# Altium schematic sheet ADSP_3.SchDoc
size A4
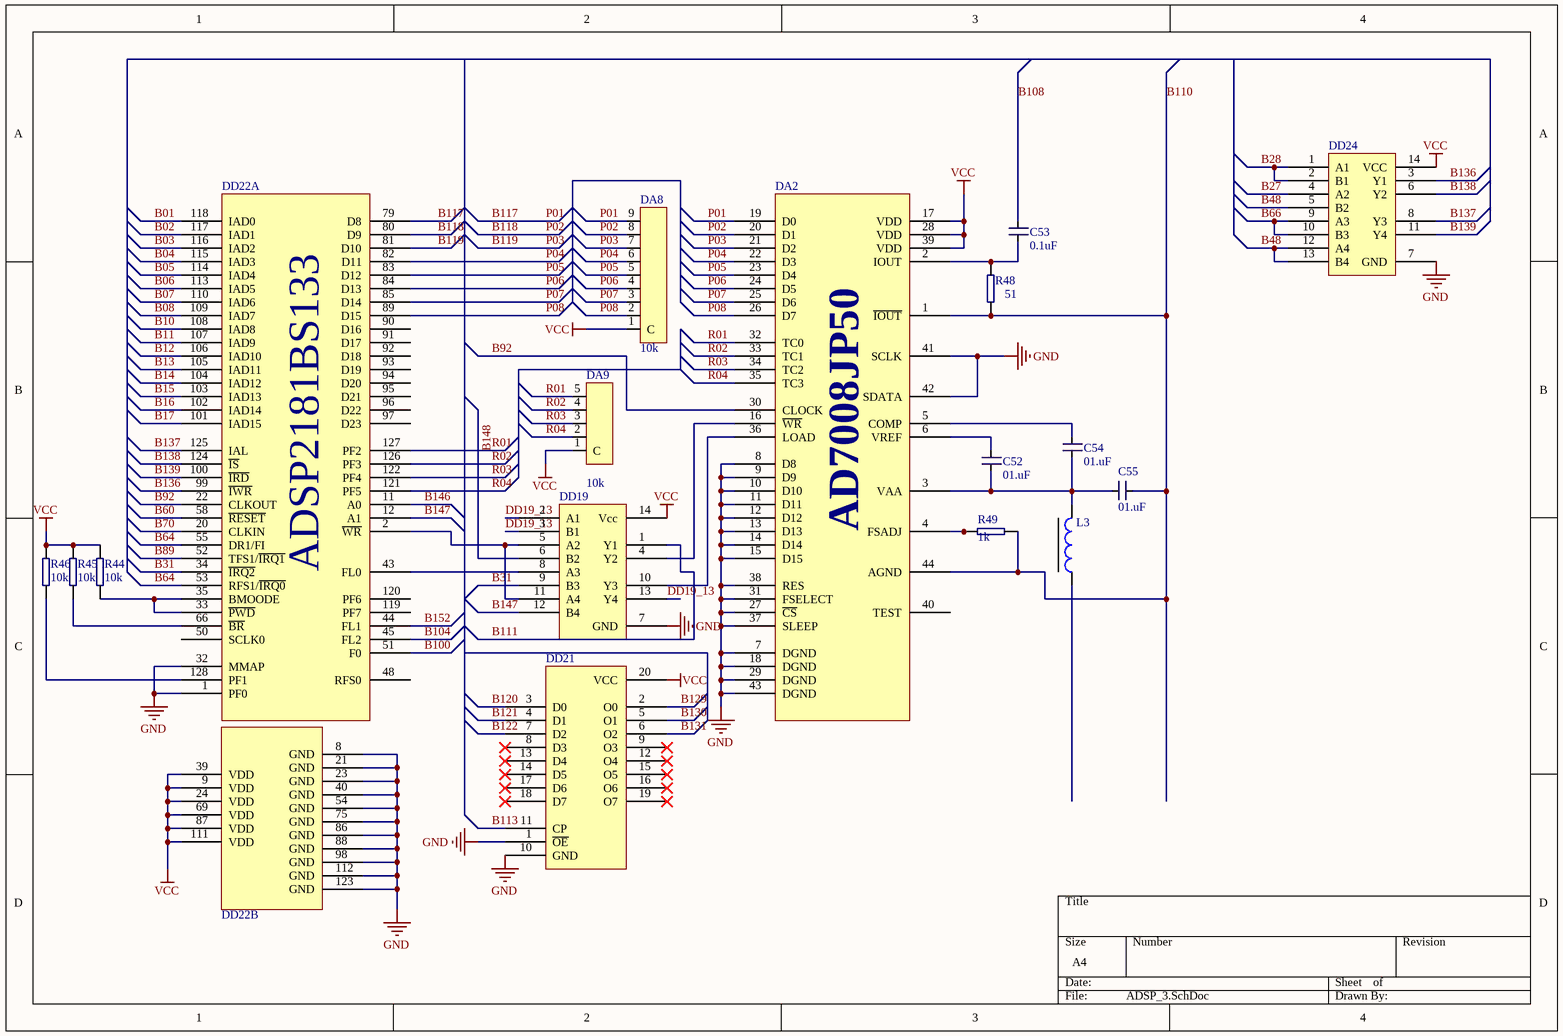
[diagram p0: ADSP_3.SchDoc]

## Parts
C52  value 01.uF  [0805]  (hidden comment: Cap)
C53  value 0.1uF  [0805]  (hidden comment: Cap)
C54  value 01.uF  [0805]  (hidden comment: Cap)
C55  value 01.uF  [0805]  (hidden comment: Cap)
DA2  AD7008JP50  [44 PLCC]  (value not drawn)
DA8  value 10k  [SIP9]  (hidden comment: 9A103J)
DA9  value 10k  [SIP5]  (hidden comment: 5A103J)
DD19  IN74AC02D  [14 SOIC-3.9]  (value not drawn)
DD21  SN74AC374D  [20 SOIC-7.5]  (value not drawn)
DD22  ADSP2181BS1332  [128 PQFP]  (value not drawn)  (parts A,B of 2)
DD24  IN74AC08D  [14 TSSOP-4.4]  (value not drawn)
L3  L  [E(1820)]  (value not drawn)
R44  value 10k  [0805]  (hidden comment: R)
R45  value 10k  [0805]  (hidden comment: R)
R46  value 10k  [0805]  (hidden comment: R)
R48  value 51  [0805]  (hidden comment: R)
R49  value 1k  [0805]  (hidden comment: R)

## Nets
GND: DA2.7(DGND) DA2.8(D8) DA2.9(D9) DA2.10(D10) DA2.11(D11) DA2.12(D12) DA2.13(D13) DA2.14(D14) DA2.15(D15) DA2.18(DGND) DA2.27(~{CS}) DA2.29(DGND) DA2.31(FSELECT) DA2.37(SLEEP) DA2.38(RES) DA2.41(SCLK) DA2.42(SDATA) DA2.43(DGND) DD19.7(GND) DD21.1(~{OE}) DD21.10(GND) DD22.1(PF0) DD22.8(GND) DD22.21(GND) DD22.23(GND) DD22.32(MMAP) DD22.40(GND) DD22.54(GND) DD22.75(GND) DD22.86(GND) DD22.88(GND) DD22.98(GND) DD22.112(GND) DD22.123(GND) DD24.7(GND)
VCC: DA2.17(VDD) DA2.28(VDD) DA2.39(VDD) DA8.1(C) DA9.1(C) DD19.14(Vcc) DD21.20(VCC) DD22.9(VDD) DD22.24(VDD) DD22.39(VDD) DD22.69(VDD) DD22.87(VDD) DD22.111(VDD) DD24.14(VCC) R44.2 R45.2 R46.2
B01: DD22.118(IAD0)
B02: DD22.117(IAD1)
B03: DD22.116(IAD2)
B04: DD22.115(IAD3)
B05: DD22.114(IAD4)
B06: DD22.113(IAD5)
B07: DD22.110(IAD6)
B08: DD22.109(IAD7)
B10: DD22.108(IAD8)
B11: DD22.107(IAD9)
B12: DD22.106(IAD10)
B13: DD22.105(IAD11)
B14: DD22.104(IAD12)
B15: DD22.103(IAD13)
B16: DD22.102(IAD14)
B17: DD22.101(IAD15)
B27: DD24.4(A2)
B28: DD24.1(A1) DD24.2(B1)
B31: DD19.9(B3) DD22.34(~{IRQ2})
B48: DD24.5(B2) DD24.12(A4) DD24.13(B4)
B60: DD22.58(~{RESET})
B64: DD22.53(RFS1/~{IRQ0}) DD22.55(DR1/FI)
B66: DD24.9(A3) DD24.10(B3)
B70: DD22.20(CLKIN)
B89: DD22.52(TFS1/~{IRQ1})
B92: DA2.30(CLOCK) DD22.22(CLKOUT)
B100: DD22.51(F0)
B104: DD22.45(FL2)
B108: C53.2
B110: C55.1 DA2.1(~{IOUT}) DA2.44(AGND) R48.1 R49.2
B111: DD19.1(Y1)
B113: DD21.11(CP)
B117: DA2.19(D0) DA8.9 DD22.79(D8)  [also labelled P01]
B118: DA2.20(D1) DA8.8 DD22.80(D9)  [also labelled P02]
B119: DA2.21(D2) DA8.7 DD22.81(D10)  [also labelled P03]
B120: DD21.3(D0)
B121: DD21.4(D1)
B122: DD21.7(D2)
B129: DD21.2(O0)
B130: DD21.5(O1)
B131: DD21.6(O2)
B136: DD22.99(~{IWR}) DD24.3(Y1)
B137: DD22.125(IAL) DD24.8(Y3)
B138: DD22.124(~{IS}) DD24.6(Y2)
B139: DD22.100(~{IRD}) DD24.11(Y4)
B146: DD22.11(A0)
B147: DD19.12(B4) DD22.12(A1)
B148: DD19.6(B2)
B152: DD22.44(FL1)
DD19_13: DD19.2(A1) DD19.3(B1) DD19.13(Y4)
P04: DA2.22(D3) DA8.6 DD22.82(D11)
P05: DA2.23(D4) DA8.5 DD22.83(D12)
P06: DA2.24(D5) DA8.4 DD22.84(D13)
P07: DA2.25(D6) DA8.3 DD22.85(D14)
P08: DA2.26(D7) DA8.2 DD22.89(D15)
R01: DA2.32(TC0) DA9.5 DD22.127(PF2)
R02: DA2.33(TC1) DA9.4 DD22.126(PF3)
R03: DA2.34(TC2) DA9.3 DD22.122(PF4)
R04: DA2.35(TC3) DA9.2 DD22.121(PF5)
NetC52_1: C52.1 C54.1 C55.2 DA2.3(VAA) L3.2
NetC52_2: C52.2 DA2.6(VREF)
NetC53_1: C53.1 DA2.2(IOUT) R48.2
NetC54_2: C54.2 DA2.5(COMP)
NetDA2_4: DA2.4(FSADJ) R49.1
NetDA2_16: DA2.16(~{WR}) DD19.4(Y2)
NetDA2_36: DA2.36(LOAD) DD19.10(Y3)
NetDD19_5: DD19.5(A2) DD19.11(A4) DD22.2(~{WR})
NetDD19_8: DD19.8(A3) DD22.43(FL0)
NetDD22_33: DD22.33(~{PWD}) DD22.35(BMOODE) R44.1
NetDD22_66: DD22.66(~{BR}) R45.1
NetDD22_128: DD22.128(PF1) R46.1

Not connected (* = marked no-connect by the designer): DA2 40(TEST); DD21 8(D3)* 9(O3)* 12(O4)* 13(D4)* 14(D5)* 15(O5)* 16(O6)* 17(D6)* 18(D7)* 19(O7)*; DD22 48(RFS0) 50(SCLK0) 90(D16) 91(D17) 92(D18) 93(D19) 94(D20) 95(D21) 96(D22) 97(D23) 119(PF7) 120(PF6); L3 1

## Notes on the sheet
- (in symbol ADSP2181BS1332, part A) ADSP2181BS133